# Altium schematic sheet I2C_Bus_Multiplexer.SchDoc: I2C Bus Multiplexer
size A4; DocumentNumber: 11; SheetNumber: 11; SheetTotal: 50
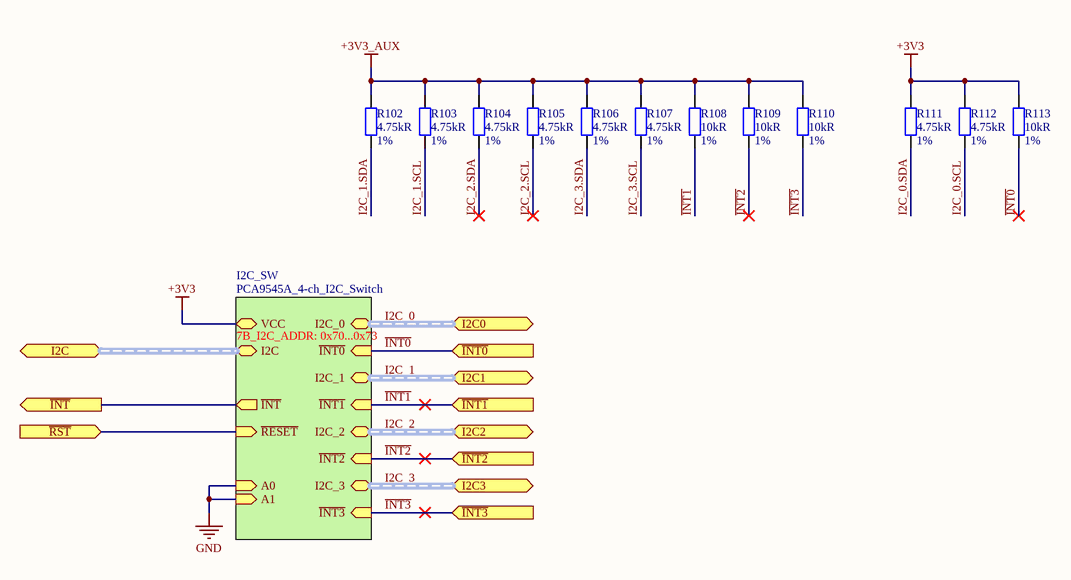
[diagram p0: I2C_Bus_Multiplexer.SchDoc]

## Parts
R102  Resistance: 4.75kR  Tolerance: 1%  [R0402]  (hidden comment: RES SMD 4.75K OHM 1% 1/16W 0402)
R103  Resistance: 4.75kR  Tolerance: 1%  [R0402]  (hidden comment: RES SMD 4.75K OHM 1% 1/16W 0402)
R104  Resistance: 4.75kR  Tolerance: 1%  [R0402]  (hidden comment: RES SMD 4.75K OHM 1% 1/16W 0402)
R105  Resistance: 4.75kR  Tolerance: 1%  [R0402]  (hidden comment: RES SMD 4.75K OHM 1% 1/16W 0402)
R106  Resistance: 4.75kR  Tolerance: 1%  [R0402]  (hidden comment: RES SMD 4.75K OHM 1% 1/16W 0402)
R107  Resistance: 4.75kR  Tolerance: 1%  [R0402]  (hidden comment: RES SMD 4.75K OHM 1% 1/16W 0402)
R108  Resistance: 10kR  Tolerance: 1%  [R0402]  (hidden comment: RES SMD 10K OHM 1% 1/16W 0402)
R109  Resistance: 10kR  Tolerance: 1%  [R0402]  (hidden comment: RES SMD 10K OHM 1% 1/16W 0402)
R110  Resistance: 10kR  Tolerance: 1%  [R0402]  (hidden comment: RES SMD 10K OHM 1% 1/16W 0402)
R111  Resistance: 4.75kR  Tolerance: 1%  [R0402]  (hidden comment: RES SMD 4.75K OHM 1% 1/16W 0402)
R112  Resistance: 4.75kR  Tolerance: 1%  [R0402]  (hidden comment: RES SMD 4.75K OHM 1% 1/16W 0402)
R113  Resistance: 10kR  Tolerance: 1%  [R0402]  (hidden comment: RES SMD 10K OHM 1% 1/16W 0402)

## Sub-sheets
I2C_SW = PCA9545A_4-ch_I2C_Switch: A1 (in), VCC, A0 (in), ~{INT} (out), ~{RESET} (in), ~{INT0} (in), ~{INT1} (in), ~{INT2} (in), ~{INT3} (in), I2C (harness I2C), I2C_0 (harness I2C), I2C_3 (harness I2C), I2C_1 (harness I2C), I2C_2 (harness I2C)  | 7B_I2C_ADDR: 0x70...0x73

## Ports
I2C0 (harness I2C), I2C1 (harness I2C), I2C2 (harness I2C), I2C3 (harness I2C), I2C (harness I2C), ~{INT0} (in), ~{INT1} (in), ~{INT2} (in), ~{INT3} (in), ~{INT} (out), ~{RST} (in)

## Nets
+3V3: R111.2 R112.2 R113.1 ; sheet I2C_SW/VCC
+3V3_AUX: R102.2 R103.2 R104.2 R105.2 R106.2 R107.2 R108.1 R109.1 R110.1
GND: sheet I2C_SW/A1, sheet I2C_SW/A0
~{INT}: port ~{INT}, sheet I2C_SW/~{INT}
~{INT0}: R113.2 ; port ~{INT0}, sheet I2C_SW/~{INT0}
~{INT1}: R108.2 ; port ~{INT1}, sheet I2C_SW/~{INT1}
~{INT2}: R109.2 ; port ~{INT2}, sheet I2C_SW/~{INT2}
~{INT3}: R110.2 ; port ~{INT3}, sheet I2C_SW/~{INT3}
~{RST}: port ~{RST}, sheet I2C_SW/~{RESET}
I2C_0.SCL: R112.1
I2C_0.SDA: R111.1
I2C_1.SCL: R103.1
I2C_1.SDA: R102.1
I2C_2.SCL: R105.1
I2C_2.SDA: R104.1
I2C_3.SCL: R107.1
I2C_3.SDA: R106.1

## Buses and harness runs
harness I2C_0 = port I2C0 = sheet I2C_SW/I2C_0
harness I2C_1 = port I2C1 = sheet I2C_SW/I2C_1
harness I2C_2 = port I2C2 = sheet I2C_SW/I2C_2
harness I2C_3 = port I2C3 = sheet I2C_SW/I2C_3
harness port I2C = sheet I2C_SW/I2C

## Notes on the sheet
- Title
- Size:
- Date:
- A4
- Number:
- Time:
- Revision:
- Sheet
- of
- File:

## Library data of the parts
R102-R107 R111 R112 = RES SMD 4.75K OHM 1% 1/16W 0402: 4.75 kOhms ±1% 0.063W, 1/16W Chip Resistor 0402 (1005 Metric) Moisture Resistant Thick Film; Manufacturer: Yageo; Manufacturer Part Number: RC0402FR-074K75P; Max Power Dissipation: 63mW; Temperature Coefficient: 150ppm/°C; Case/Package: 0402; Supplier 1: Digi-Key; Stock 1: 23485; Pricing 1: 1=0.1, 10=0.035, 100=0.014, 1000=0.0063, 2500=0.0055, 5000=0.0045 (USD); Case Code (Metric): 1005; Case Code (Imperial): 0402; Min Operating Temperature: -55°C; Max Operating Temperature: 155°C; Packaging: Tape and Reel; Composition: Thick Film; Number of Terminations: 2; Features: Moisture Resistant; Length: 0.039inch; Height: 0.016inch; Width: 0.02inch; ComponentLink1URL: http://www.yageo.com/NewPortal/yageodocoutput?fileName=/pdf/R-Chip/PYu-RC_51_RoHS_P_0.pdf&src-supplier=Digi-Key; ComponentLink1Description: http://www.yageo.com/NewPortal/yageodocoutput?fileName=/pdf/R-Chip/PYu-RC_51_RoHS_P_0.pdf&src-supplier=Digi-Key; ComponentLink2URL: http://www.yageo.com.tw/exep/pages/download/literatures/PYu-R_INT-thick_7.pdf?src-supplier=Digi-Key; ComponentLink2Description: http://www.yageo.com.tw/exep/pages/download/literatures/PYu-R_INT-thick_7.pdf?src-supplier=Digi-Key; Supplier Part Number 1: YAG1271CT-ND; ClassName: I2C_SW; Mount: Surface Mount
R108-R110 R113 = RES SMD 10K OHM 1% 1/16W 0402: 10 kOhms ±1% 0.063W, 1/16W Chip Resistor 0402 (1005 Metric) Moisture Resistant Thick Film; Manufacturer: Yageo; Manufacturer Part Number: RC0402FR-0710KP; Max Power Dissipation: 63mW; Temperature Coefficient: 150ppm/°C; Case/Package: 0402; Supplier 1: Digi-Key; Stock 1: 839368; Pricing 1: 1=0.1, 10=0.035, 100=0.014, 1000=0.0063, 2500=0.0055, 5000=0.0045 (USD); Case Code (Metric): 1005; Case Code (Imperial): 0402; Min Operating Temperature: -55°C; Max Operating Temperature: 155°C; Packaging: Tape and Reel; Composition: Thick Film; Number of Terminations: 2; Features: Moisture Resistant; Length: 0.039inch; Height: 0.016inch; Width: 0.02inch; ComponentLink1URL: http://www.yageo.com/NewPortal/yageodocoutput?fileName=/pdf/R-Chip/PYu-RC_51_RoHS_P_0.pdf&src-supplier=Digi-Key; ComponentLink1Description: http://www.yageo.com/NewPortal/yageodocoutput?fileName=/pdf/R-Chip/PYu-RC_51_RoHS_P_0.pdf&src-supplier=Digi-Key; Supplier Part Number 1: YAG1249CT-ND; ClassName: I2C_SW; Mount: Surface Mount